# Altium schematic sheet Схема электрическая принципиальная имитации напряжения, тока и сопротивления.SchDoc
size 420 x 297 mm; Разраб.: Разраб.; Пров.: Пров.; Т.контр.: Т. контр.; Н.контр.: Н. контр; Утв.: Утв.; Лист: 1; Листов: 4; Децим.  №: ХXX.XXXXX.XXX.Э3; Название: Название; Лист.: 1; Листов.: 1
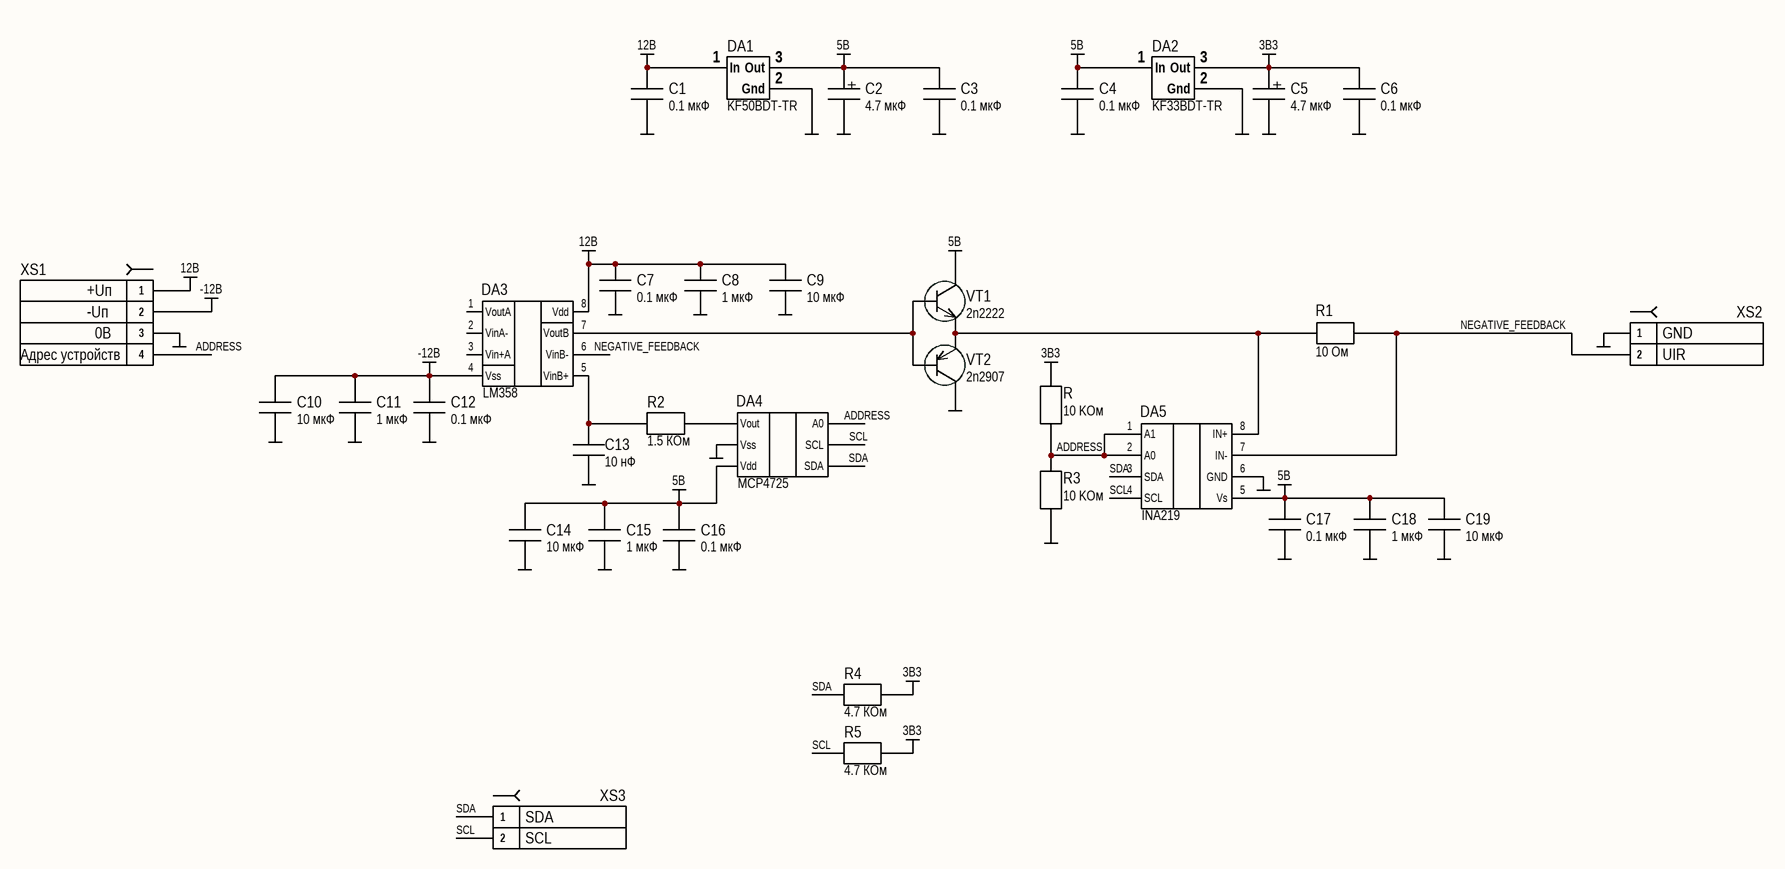
[diagram p0: Схема электрическая принципиальная имитации напряжения, тока и сопротивления.SchDoc]

## Parts
C1  0.1 мкФ  [CAP 0603 3D]
C2  4.7 мкФ  [Tant A]
C3  0.1 мкФ  [CAP 0603 3D]
C4  0.1 мкФ  [CAP 0603 3D]
C5  4.7 мкФ  [Tant A]
C6  0.1 мкФ  [CAP 0603 3D]
C7  0.1 мкФ  [CAP 0603 3D]
C8  1 мкФ  [CAP 0603 3D]
C9  10 мкФ  [cap 1206 3D]
C10  10 мкФ  [cap 1206 3D]
C11  1 мкФ  [CAP 0603 3D]
C12  0.1 мкФ  [CAP 0603 3D]
C13  10 нФ  [CAP 0603 3D]
C14  10 мкФ  [cap 1206 3D]
C15  1 мкФ  [CAP 0603 3D]
C16  0.1 мкФ  [CAP 0603 3D]
C17  0.1 мкФ  [CAP 0603 3D]
C18  1 мкФ  [CAP 0603 3D]
C19  10 мкФ  [cap 1206 3D]
DA1  KF50BDT-TR  [DPAK]
DA2  KF33BDT-TR  [DPAK]
DA3  LM358  [SOIC-8 150mil]
DA4  MCP4725  [SOT23-6]
DA5  INA219  [SOP-8]
R  10 KОм  [Res_0603 3D]
R1  10 Ом  [Res_2512 3D]
R2  1.5 КОм  [Res_0603 3D]
R3  10 KОм  [Res_0603 3D]
R4  4.7 КОм  [Res_0603 3D]
R5  4.7 КОм  [Res_0603 3D]
VT1  2n2222  [TO-92 EBC (2)]
VT2  2n2907  [TO-92 EBC (2)]
XS1  KF-301-4P  [Degson_DG301-5.0-04P-1X]  (value not drawn)
XS2  KF-301-2P  [Degson_DG301-5.0-02P-1X]  (value not drawn)
XS3  KF-301-2P  [Degson_DG301-5.0-02P-1X]  (value not drawn)

## Nets
3В3: C5.1(+) C6.1 DA2.3(Out) R.2 R4.2 R5.2
5В: C2.1(+) C3.1 C4.1 C14.1 C15.1 C16.1 C17.1 C18.1 C19.1 DA1.3(Out) DA2.1(In) DA4.3(Vdd) DA5.5(Vs) VT1.2(C)
12В: C1.2 C7.1 C8.2 C9.1 DA1.1(In) DA3.8(Vdd) XS1.1
-12В: C10.1 C11.2 C12.1 DA3.4(Vss) XS1.2
GND: C1.1 C2.2(-) C3.2 C4.2 C5.2(-) C6.2 C7.2 C8.1 C9.2 C10.2 C11.1 C12.2 C13.2 C14.2 C15.2 C16.2 C17.2 C18.2 C19.2 DA1.2(Gnd) DA2.2(Gnd) DA4.2(Vss) DA5.6(GND) R3.1 VT2.2(C) XS1.3 XS2.1
ADDRESS: DA4.6(A0) DA5.1(A1) DA5.2(A0) R.1 R3.2 XS1.4
NEGATIVE_FEEDBACK: DA3.6(VinB-) DA5.7(IN-) R1.2 XS2.2
SCL: DA4.5(SCL) DA5.4(SCL) R5.1 XS3.2
SDA: DA4.4(SDA) DA5.3(SDA) R4.1 XS3.1
NetC13_1: C13.1 DA3.5(VinB+) R2.1
NetDA3_7: DA3.7(VoutB) VT1.1(B) VT2.1(B)
NetDA4_1: DA4.1(Vout) R2.2
NetDA5_8: DA5.8(IN+) R1.1 VT1.3(E) VT2.3(E)

Not connected (* = marked no-connect by the designer): DA3 1(VoutA) 2(VinA-) 3(Vin+A)

## Notes on the sheet
- (near XS1) +Uп
- (near XS1) Адрес устройств
- (near XS1) -Uп
- (near XS1) 0В
- (near XS2) UIR
- (near XS2) GND
- (near XS3) SDA
- (near XS3) SCL
- Перв. примен.
- Справ. №
- Подп. и дата
- Инв. № дубл.
- Взам. инв. №
- Изм.
- Лист
- № докум
- Подпись
- Дата
- Лит.
- Масса
- Масштаб
- Разраб
- Пров
- Т.контр.
- Листов
- Инв.№ подл.
- Н.контр.
- Утв.

## Library data of the parts
C1 C3 C4 C6-C8 C11-C13 C15-C18 = C: Конденсатор керамика
C2 C5 = C T: Конденсатор тантал, Тип А
C9 C10 C14 C19 = C: Конденсатор керамика 1206
DA1 = MC78Mхх: Линейный стабилизатор напряжения  5V
DA2 = MC78Mхх: Линейный стабилизатор напряжения  5 - 15V
DA3 = MCP602
R R2-R5 = R: Резисторы плёночные (SMD; МЛТ; С2-33Н; MP9xxx)
R1 = R: Резисторы плёночные (SMD; МЛТ; С2-33Н; MP9xxx), 2512
VT1 = VT NPN: Транзистор NPN
VT2 = VT PNP: Транзистор PNP